# Altium schematic sheet 39.SchDoc
size 513 x 386 mm
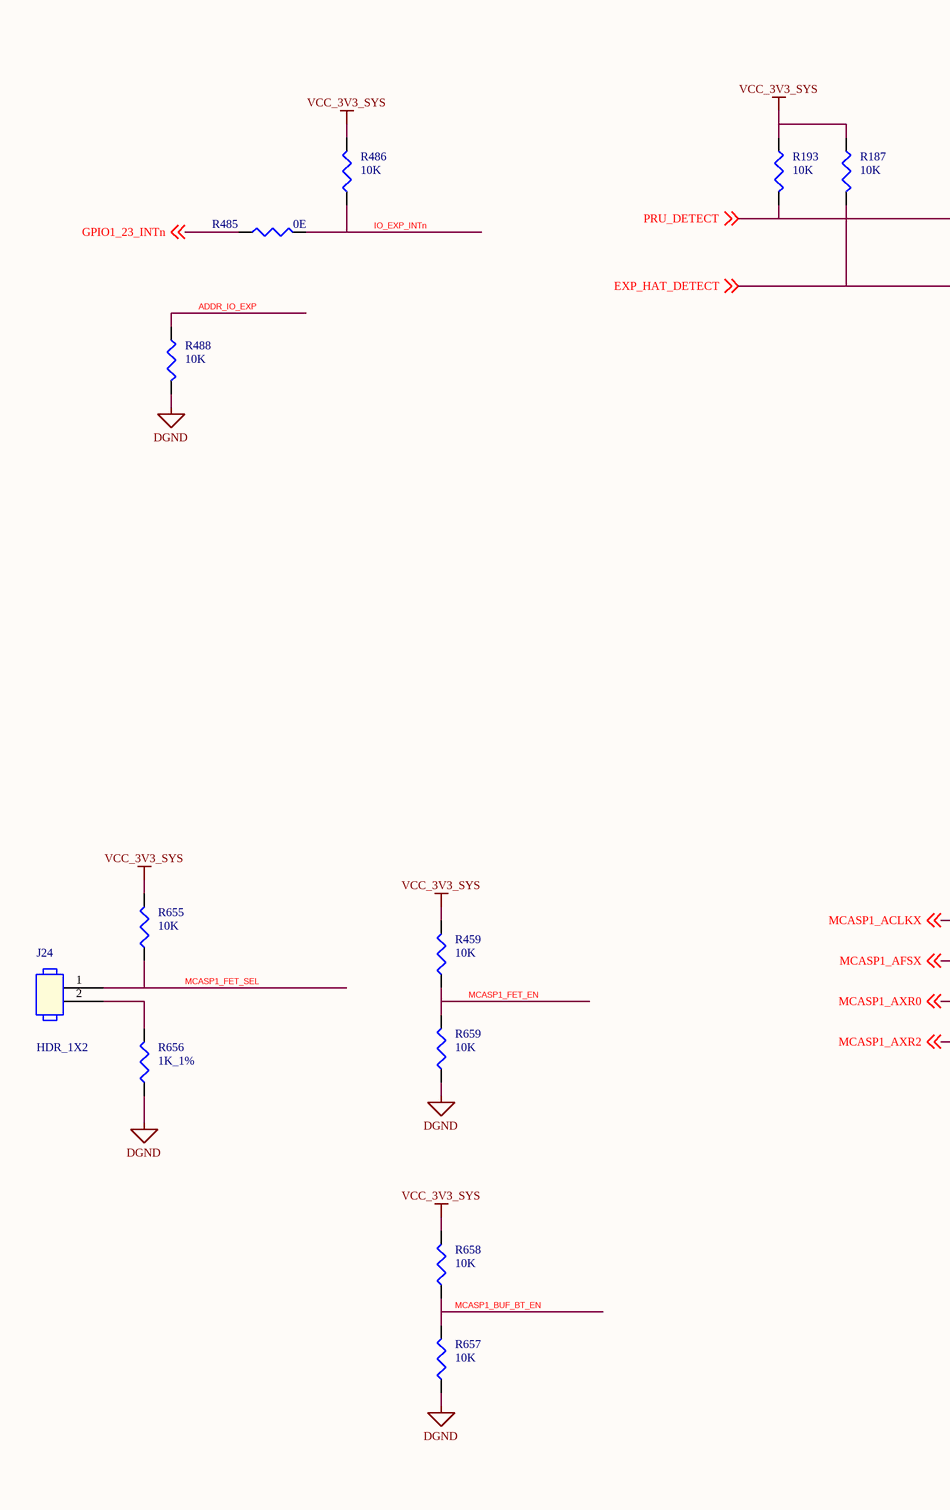
[diagram p0: 39.SchDoc, left]
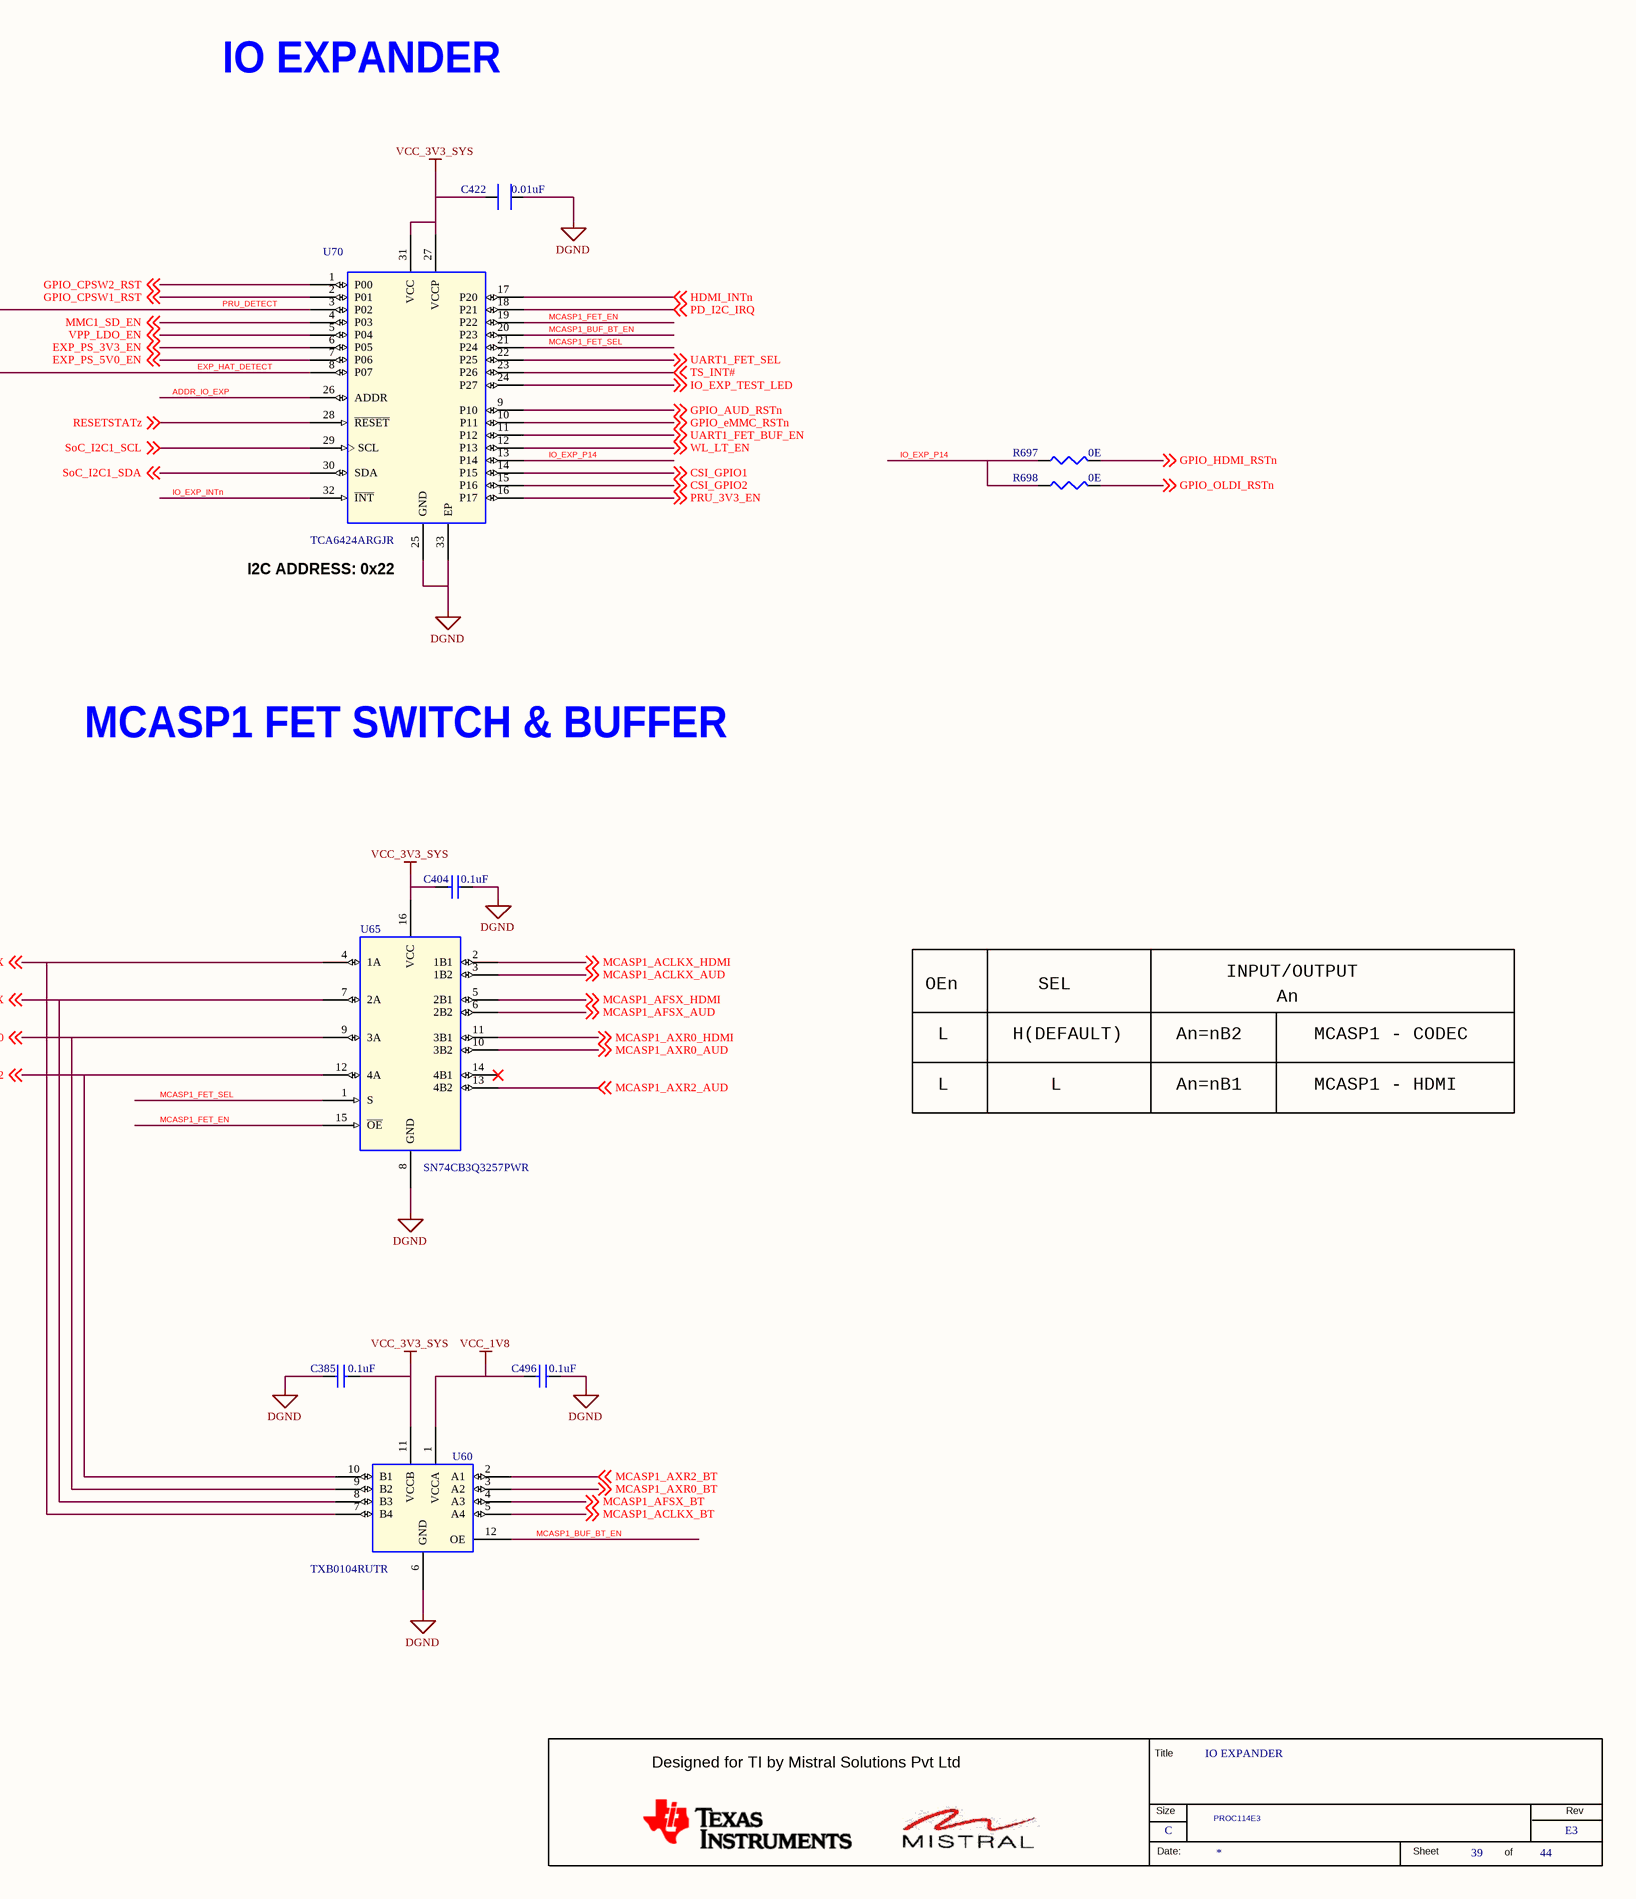
[diagram p1: 39.SchDoc, right]

## Parts
*  RevCode: E3  Title: IO EXPANDER  Page Size: C  Page Number: 39  Page Count: 44  Variant Name: PROC114E3  (hidden comment: MISTRAL_TITLEBLK_CSIZE)  (graphical)
C385  0.1uF  [CAP0201_0-5]
C404  0.1uF  [CAP0201_0-5]
C422  0.01uF  [CAP0402N]
C496  0.1uF  [CAP0201_0-5]
J24  HDR_1X2  [HDR_1X2_90120-0122_S_T_5-6]
R187  10K  [RES0201_0-5]
R193  10K  [RES0201_0-5]
R459  10K  [RES0201_0-5]
R485  0E  [RES0402_0-5]
R486  10K  [RES0201_0-5]
R488  10K  [RES0201_0-5]
R655  10K  [RES0201_0-5]
R656  1K_1%  [RES0402_0-5]
R657  10K  [RES0201_0-5]
R658  10K  [RES0201_0-5]
R659  10K  [RES0201_0-5]
R697  0E  [RES0201_0-5]
R698  0E  [RES0201_0-5]
U60  TXB0104RUTR  [UQFN12_TXB0104RUT_70X80_0-6]
U65  SN74CB3Q3257PWR  [TSSOP16_25-59_205X180]
U70  TCA6424ARGJR  [QFN32_19-68_200X200]

## Nets
DGND: C385.1 C404.1 C422.1 C496.1 R488.1 R656.1 R657.1 R659.1 U60.6(GND) U65.8(GND) U70.25(GND) U70.33(EP)
VCC_1V8: C496.2 U60.1(VCCA)
VCC_3V3_SYS: C385.2 C404.2 C422.2 R187.2 R193.2 R459.2 R486.2 R655.2 R658.2 U60.11(VCCB) U65.16(VCC) U70.27(VCCP) U70.31(VCC)
ADDR_IO_EXP: R488.2 U70.26(ADDR)
CSI_GPIO1: U70.14(P15) ; off-sheet CSI_GPIO1
CSI_GPIO2: U70.15(P16) ; off-sheet CSI_GPIO2
EXP_HAT_DETECT: R187.1 U70.8(P07) ; off-sheet EXP_HAT_DETECT
EXP_PS_3V3_EN: U70.6(P05) ; off-sheet EXP_PS_3V3_EN
EXP_PS_5V0_EN: U70.7(P06) ; off-sheet EXP_PS_5V0_EN
GPIO1_23_INTn: R485.1 ; off-sheet GPIO1_23_INTn
GPIO_AUD_RSTn: U70.9(P10) ; off-sheet GPIO_AUD_RSTn
GPIO_CPSW1_RST: U70.2(P01) ; off-sheet GPIO_CPSW1_RST
GPIO_CPSW2_RST: U70.1(P00) ; off-sheet GPIO_CPSW2_RST
GPIO_eMMC_RSTn: U70.10(P11) ; off-sheet GPIO_eMMC_RSTn
GPIO_HDMI_RSTn: R697.2 ; off-sheet GPIO_HDMI_RSTn
GPIO_OLDI_RSTn: R698.2 ; off-sheet GPIO_OLDI_RSTn
HDMI_INTn: U70.17(P20) ; off-sheet HDMI_INTn
IO_EXP_INTn: R485.2 R486.1 U70.32(~{INT})
IO_EXP_P14: R697.1 R698.1 U70.13(P14)
IO_EXP_TEST_LED: U70.24(P27) ; off-sheet IO_EXP_TEST_LED
MCASP1_ACLKX: U60.7(B4) U65.4(1A) ; off-sheet MCASP1_ACLKX
MCASP1_ACLKX_AUD: U65.3(1B2) ; off-sheet MCASP1_ACLKX_AUD
MCASP1_ACLKX_BT: U60.5(A4) ; off-sheet MCASP1_ACLKX_BT
MCASP1_ACLKX_HDMI: U65.2(1B1) ; off-sheet MCASP1_ACLKX_HDMI
MCASP1_AFSX: U60.8(B3) U65.7(2A) ; off-sheet MCASP1_AFSX
MCASP1_AFSX_AUD: U65.6(2B2) ; off-sheet MCASP1_AFSX_AUD
MCASP1_AFSX_BT: U60.4(A3) ; off-sheet MCASP1_AFSX_BT
MCASP1_AFSX_HDMI: U65.5(2B1) ; off-sheet MCASP1_AFSX_HDMI
MCASP1_AXR0: U60.9(B2) U65.9(3A) ; off-sheet MCASP1_AXR0
MCASP1_AXR0_AUD: U65.10(3B2) ; off-sheet MCASP1_AXR0_AUD
MCASP1_AXR0_BT: U60.3(A2) ; off-sheet MCASP1_AXR0_BT
MCASP1_AXR0_HDMI: U65.11(3B1) ; off-sheet MCASP1_AXR0_HDMI
MCASP1_AXR2: U60.10(B1) U65.12(4A) ; off-sheet MCASP1_AXR2
MCASP1_AXR2_AUD: U65.13(4B2) ; off-sheet MCASP1_AXR2_AUD
MCASP1_AXR2_BT: U60.2(A1) ; off-sheet MCASP1_AXR2_BT
MCASP1_BUF_BT_EN: R657.2 R658.1 U60.12(OE) U70.20(P23)
MCASP1_FET_EN: R459.1 R659.2 U65.15(~{OE}) U70.19(P22)
MCASP1_FET_SEL: J24.1 R655.1 U65.1(S) U70.21(P24)
MMC1_SD_EN: U70.4(P03) ; off-sheet MMC1_SD_EN
PD_I2C_IRQ: U70.18(P21) ; off-sheet PD_I2C_IRQ
PRU_3V3_EN: U70.16(P17) ; off-sheet PRU_3V3_EN
PRU_DETECT: R193.1 U70.3(P02) ; off-sheet PRU_DETECT
RESETSTATz: U70.28(~{RESET}) ; off-sheet RESETSTATz
SoC_I2C1_SCL: U70.29(SCL) ; off-sheet SoC_I2C1_SCL
SoC_I2C1_SDA: U70.30(SDA) ; off-sheet SoC_I2C1_SDA
TS_INT#: U70.23(P26) ; off-sheet TS_INT#
UART1_FET_BUF_EN: U70.11(P12) ; off-sheet UART1_FET_BUF_EN
UART1_FET_SEL: U70.22(P25) ; off-sheet UART1_FET_SEL
VPP_LDO_EN: U70.5(P04) ; off-sheet VPP_LDO_EN
WL_LT_EN: U70.12(P13) ; off-sheet WL_LT_EN
NetJ24_2: J24.2 R656.2

Not connected (* = marked no-connect by the designer): U65 14(4B1)*

## Notes on the sheet
- IO EXPANDER
- (near U70) I2C ADDRESS: 0x22
- MCASP1 FET SWITCH & BUFFER
- OEn
- SEL
- INPUT/OUTPUT
- An
- L
- H(DEFAULT)
- An=nB2
- MCASP1 - CODEC
- An=nB1
- MCASP1 - HDMI
- (in symbol MISTRAL_TITLEBLK_CSIZE) Title; Designed for TI by Mistral Solutions Pvt Ltd; Size; Rev; Date:; Sheet; of

## Library data of the parts
* = MISTRAL_TITLEBLK_CSIZE: Issue: 1.0; Page Create Date: March  8, 1995; Page Modify Date: *; Schematic Page Count: 44; Schematic Page Number: 39
C385 C404 = CAP_Dup2: CAP CERAMIC 0.1uF 16V 10% X5R 0201; Alt_Mfr_part_number: CC0402KRX5R8BB104; Mistral Part No: 120009030072-R; Mfr_name: MURATA; Mfr_part_number: GRM033R61C104KE14D; Part_type: CAPACITORS\CERAMIC; Alt_Mfr_name: YAGEO AMERICA; Project: TI_MAXIE_CPB; Wattage: NA; Customs_HS_Code: 85322990; Custom_Duty: 15%; PCB Footprint: CAP0201_0-5; Tolerance: 10%; Voltage: 16V; Package: 0201; Distributor_name: DIGIKEY; Distributor_part_number: 490-14305-1-ND; Height: 0.33MM; Weight: 0.33mg; Temperature: -55°C+85°C; Datasheet: Y:\MIS_DATABASE\DATASHEETS\CAPACITORS\GRM033R61C104KE14.PDF; Crtd /date: MANIRAJA/230118; Chkd/date: MANIRAJA/230118; MECHANICAL 3D STEP FILE: CAP0201_0-5; Library Ref: CAP; Footprint Ref: CAP0201_0-5; Library Path: Y:\MIS_DATABASE\Library\ALTIUM_TOOL\SCHEMATICS_PARTS\MS_DISCRETE_Library.schlib; Footprint Path: Y:\MIS_DATABASE\Library\ALTIUM_TOOL\PCB_FOOTPRINTS\Altium_Footprint_Lib.PcbLib
C422 = CAP_Dup3: CAP CERAMIC 0.01uF 25V 10% X5R 0201; Part_type: CAPACITORS\CERAMIC; Mfr_part_number: GRM033R61E103KA12J; Mfr_name: MURATA; Mistral Part No: 120018010007-R; PCB Footprint: CAP0201_0-5; Wattage: NA; Custom_Duty: 15%; Customs_HS_Code: 85322990; Project: TI_MAXIE_CPB; Footprint Path: Y:\MIS_DATABASE\Library\ALTIUM_TOOL\PCB_FOOTPRINTS\Altium_Footprint_Lib.PcbLib; Library Path: Y:\MIS_DATABASE\Library\ALTIUM_TOOL\SCHEMATICS_PARTS\MS_DISCRETE_Library.schlib; Footprint Ref: CAP0201_0-5; MECHANICAL 3D STEP FILE: CAP0201_0-5; Temperature: -55°C+85°C; Weight: 0.33mg; Chkd/date: MANIRAJA/230118; Crtd /date: MANIRAJA/230118; Datasheet: Y:\MIS_DATABASE\DATASHEETS\CAPACITORS\GRM033R61E103KA12.PDF; Height: 0.33MM; Distributor_part_number: GRM033R61E103KA12J-ND; Distributor_name: DIGIKEY; Package: 0201; Voltage: 25V; Tolerance: 10%; Library Ref: CAP
C496 = CAP_Dup2: CAP CERAMIC 0.1uF 16V 10% X5R 0201; Alt_Mfr_name: YAGEO AMERICA; Part_type: CAPACITORS\CERAMIC; Mfr_part_number: GRM033R61C104KE14D; Mfr_name: MURATA; Mistral Part No: 120009030072-R; Alt_Mfr_part_number: CC0402KRX5R8BB104; Custom_Duty: 15%; Customs_HS_Code: 85322990; Wattage: NA; Project: TI_MAXIE_CPB; PCB Footprint: CAP0201_0-5; Footprint Path: Y:\MIS_DATABASE\Library\ALTIUM_TOOL\PCB_FOOTPRINTS\Altium_Footprint_Lib.PcbLib; Library Path: Y:\MIS_DATABASE\Library\ALTIUM_TOOL\SCHEMATICS_PARTS\MS_DISCRETE_Library.schlib; Footprint Ref: CAP0201_0-5; Library Ref: CAP; MECHANICAL 3D STEP FILE: CAP0201_0-5; Chkd/date: MANIRAJA/230118; Crtd /date: MANIRAJA/230118; Datasheet: Y:\MIS_DATABASE\DATASHEETS\CAPACITORS\GRM033R61C104KE14.PDF; Temperature: -55°C+85°C; Weight: 0.33mg; Height: 0.33MM; Distributor_part_number: 490-14305-1-ND; Distributor_name: DIGIKEY; Package: 0201; Voltage: 16V; Tolerance: 10%
J24 = HEADER_2X1: CON HDR 1X2 2.54MM PITCH ST TH; Part_type: CONNECTOR\HEADERS; Mfr_part_number: 90120-0122; Mfr_name: MOLEX; Mistral Part No: 150012100005-R; Custom_Duty: 24%; Customs_HS_Code: 85369090; Project: NPOL_FEP; Tolerance: NA; Chkd/date: NAVEED/210714; Crtd /date: USMAN/031012; Datasheet: Y:\MIS_DATABASE\DATASHEETS\CONNECTORS\90120-XX.PDF; Height: 5.60MM; Distributor_part_number: WM8072-ND; Distributor_name: DIGIKEY; Package: THRU-HOLE; Voltage: NA; Wattage: NA; Weight: 122mg; Temperature: -55°C+125°C; MECHANICAL 3D STEP FILE: HDR_1X2_90120-0122_S_T_5-6; Library Path: Y:\MIS_DATABASE\Library\ALTIUM_TOOL\SCHEMATICS_PARTS\MS_CONNECTOR_Library.schlib; Footprint Path: Y:\MIS_DATABASE\Library\ALTIUM_TOOL\PCB_FOOTPRINTS\Altium_Footprint_Lib.PcbLib; Library Ref: HEADER_2X1; Footprint Ref: HDR_1X2_90120-0122_S_T_5-6; PCB Footprint: HDR_1X2_90120-0122_S_T_5-6
R187 R193 R486 R488 = RESISTOR_Dup6: RES 10K 1/20W 5% 0201; Part_type: RESISTORS\FIXED; Mfr_part_number: RC0201JR-0710KL; Mfr_name: YAGEO AMERICA; Mistral Part No: 110010070051-R; Custom_Duty: 15%; Customs_HS_Code: 85332119; Voltage: NA; Project: GOLDEN-I LITE; PCB Footprint: RES0201_0-5; MECHANICAL 3D STEP FILE: RES0201_0-5; Chkd/date: MANIRAJA/050517; Crtd /date: MANIRAJA/050517; Datasheet: Y:\MIS_DATABASE\DATASHEETS\RESISTORS\RCXXXXL-SER_MAR18.PDF; Temperature: -55°C+125°C; Weight: 0.17mg; Height: 0.26MM; Distributor_part_number: 311-10KNCT-ND; Distributor_name: DIGIKEY; Package: 0201; Wattage: 1/20W; Tolerance: 5%; Library Ref: RESISTOR; Footprint Ref: RES0201_0-5; Library Path: Y:\MIS_DATABASE\Library\ALTIUM_TOOL\SCHEMATICS_PARTS\MS_DISCRETE_Library.schlib; Footprint Path: Y:\MIS_DATABASE\Library\ALTIUM_TOOL\PCB_FOOTPRINTS\Altium_Footprint_Lib.PcbLib
R459 R655 R657-R659 = RESISTOR_Dup6: RES 10K 1/20W 5% 0201; Mistral Part No: 110010070051-R; Mfr_name: YAGEO AMERICA; Mfr_part_number: RC0201JR-0710KL; Part_type: RESISTORS\FIXED; Project: GOLDEN-I LITE; Voltage: NA; Customs_HS_Code: 85332119; Custom_Duty: 15%; Footprint Path: Y:\MIS_DATABASE\Library\ALTIUM_TOOL\PCB_FOOTPRINTS\Altium_Footprint_Lib.PcbLib; Library Path: Y:\MIS_DATABASE\Library\ALTIUM_TOOL\SCHEMATICS_PARTS\MS_DISCRETE_Library.schlib; Footprint Ref: RES0201_0-5; Library Ref: RESISTOR; Tolerance: 5%; Wattage: 1/20W; Package: 0201; Distributor_name: DIGIKEY; Distributor_part_number: 311-10KNCT-ND; Height: 0.26MM; Weight: 0.17mg; Temperature: -55°C+125°C; Datasheet: Y:\MIS_DATABASE\DATASHEETS\RESISTORS\RCXXXXL-SER_MAR18.PDF; Crtd /date: MANIRAJA/050517; Chkd/date: MANIRAJA/050517; MECHANICAL 3D STEP FILE: RES0201_0-5; PCB Footprint: RES0201_0-5
R485 = RESISTOR_Dup6: RES 0E 1/16W JUMPER 0402; Mistral Part No: 110010080019-R; Mfr_name: VISHAY; Mfr_part_number: CRCW04020000Z0ED; Part_type: RESISTORS\FIXED; Project: PB_BUGBASE; Tolerance: NA; Customs_HS_Code: 85332119; Custom_Duty: 15%; PCB Footprint: RES0402_0-5; Footprint Ref: RES0402_0-5; Voltage: NA; Wattage: 1/16W; Package: 0402; Distributor_name: DIGIKEY; Distributor_part_number: 541-0.0JCT-ND; Library Ref: RESISTOR; Height: 0.40MM; Weight: 0.65mg; Temperature: -55°C+155°C; Datasheet: Y:\MIS_DATABASE\DATASHEETS\RESISTORS\CRCW0603.PDF; Crtd /date: MUDDU/190810; Chkd/date: VASANTHA/201216; MECHANICAL 3D STEP FILE: RES0402_0-5; Library Path: Y:\MIS_DATABASE\Library\ALTIUM_TOOL\SCHEMATICS_PARTS\MS_DISCRETE_Library.schlib; Footprint Path: Y:\MIS_DATABASE\Library\ALTIUM_TOOL\PCB_FOOTPRINTS\Altium_Footprint_Lib.PcbLib
R656 = RESISTOR_Dup4: RES 1K 1/10W 1% 0402; Part_type: RESISTORS\FIXED; Mfr_part_number: ERJ-2RKF1001X; Mfr_name: PANASONIC-ECG; Mistral Part No: 110009030411-R; Custom_Duty: 15%; Customs_HS_Code: 85332119; Voltage: NA; Project: VOCERA; PCB Footprint: RES0402_0-5; Chkd/date: VASANTHA/281216; Crtd /date: MAZHAR/150506; Datasheet: Y:\MIS_DATABASE\DATASHEETS\RESISTORS\PAN-ERJSER_NOV17.PDF; Temperature: -55°C+155°C; Weight: 0.8mg; Height: 0.40MM; Distributor_part_number: P1.00KLCT-ND; Distributor_name: DIGIKEY; Package: 0402; Wattage: 1/10W; Tolerance: 1%; Library Ref: RESISTOR; Footprint Ref: RES0402_0-5; MECHANICAL 3D STEP FILE: RES0402_0-5; Library Path: Y:\MIS_DATABASE\Library\ALTIUM_TOOL\SCHEMATICS_PARTS\MS_DISCRETE_Library.schlib; Footprint Path: Y:\MIS_DATABASE\Library\ALTIUM_TOOL\PCB_FOOTPRINTS\Altium_Footprint_Lib.PcbLib
R697 R698 = RESISTOR_Dup6: RES 0E 1/20W 5% 0201; Part_type: RESISTORS\FIXED; Mfr_part_number: RC0201JR-070RL; Mfr_name: YAGEO AMERICA; Mistral Part No: 110010070067-R; Custom_Duty: 15%; Customs_HS_Code: 85332119; Voltage: NA; Project: PB_BUGBASE; Footprint Path: Y:\MIS_DATABASE\Library\ALTIUM_TOOL\PCB_FOOTPRINTS\Altium_Footprint_Lib.PcbLib; Library Path: Y:\MIS_DATABASE\Library\ALTIUM_TOOL\SCHEMATICS_PARTS\MS_DISCRETE_Library.schlib; MECHANICAL 3D STEP FILE: RES0201_0-5; Chkd/date: NAVEED/301214; Crtd /date: MUDDU/120710; Datasheet: Y:\MIS_DATABASE\DATASHEETS\RESISTORS\RCXXXXL-SER_MAR18.PDF; Temperature: -55°C+125°C; Weight: 0.17mg; Height: 0.26MM; Library Ref: RESISTOR; Distributor_part_number: 311-0.0NCT-ND; Distributor_name: DIGIKEY; Package: 0201; Wattage: 1/20W; Tolerance: 5%; Footprint Ref: RES0201_0-5; PCB Footprint: RES0201_0-5
U60 = TXB0104RUTR_UQFN12: IC 4-BIT BIDIRECTIONAL VOLTAGE-LEVEL TRANSLATOR UQFN12; Mistral Part No: 141017110007-R; Manufacturer: TEXAS INSTRUMENTS; Part_type: ICS\INTERFACE\LEVEL TRANSLATOR; Project: RSAPR_TYPE-II_3U-SBC; Tolerance: NA; Customs_HS_Code: 85423100; Custom_Duty: 15%; Mfr_part_number: TXB0104RUTR; Voltage: NA; Wattage: NA; Package: UQFN12; Distributor_name: DIGIKEY; Distributor_part_number: 296-25888-1-ND; Library Ref: TXB0104RUTR_UQFN12; Height: 0.55MM; Weight: 4.70mg; Temperature: -40°C+85°C; Datasheet: Y:\MIS_DATABASE\DATASHEETS\ICS\INTERFACE\TXB0104.PDF; Crtd /date: ALVY/271117; Chkd/date: MANIRAJA/281117; MECHANICAL 3D STEP FILE: UQFN12_TXB0104RUT_70X80_0-6; PCB Footprint: UQFN12_TXB0104RUT_70X80_0-6
U65 = SN74CB3Q3257PWR_TSSOP16: IC 4BIT 1-OF-2 FET MULTIPLEXER/DEMULTIPLEXER TSSOP16; Mistral Part No: 141009030117-R; Manufacturer: TEXAS INSTRUMENTS; Part_type: ICS\DIGITAL\COMBINATIONAL; Project: OMAP_EVM; Customs_HS_Code: 85423100; Custom_Duty: 15%; PCB Footprint: TSSOP16_25-59_205X180; Mfr_part_number: SN74CB3Q3257PWR; Package: TSSOP16; Distributor_name: DIGIKEY; Distributor_part_number: 296-19138-1-ND; Library Ref: SN74CB3Q3257PWR_TSSOP16; Height: 1.20MM; Temperature: -40°C+85°C; Datasheet: Y:\MIS_DATABASE\DATASHEETS\ICS\DIGITAL\COMBINATIONAL\SN74CB3Q3257.PDF; Crtd /date: USMAN/060109; Chkd/date: SUHAS/251010; RoHS: Sb/ Br FREE
U70 = TCA6424ARGJR_QFN32: IC I2C I/O EXPANDER 24B UQFN32; Mistral Part No: 141014090009-R; Mfr_name: TEXAS INSTRUMENTS; Part_type: ICS\DIGITAL\BUSTRANSCEIVER; Project: ZK_BIOMETRIC; Customs_HS_Code: 85423100; Custom_Duty: 15%; PCB Footprint: QFN32_19-68_200X200; Mfr_part_number: TCA6424ARGJR; Package: UQFN32; Distributor_name: DIGIKEY; Distributor_part_number: 296-27844-1-ND; Library Ref: TCA6424ARGJR_QFN32; Height: 0.60MM; Weight: NA; Temperature: -40°C+85°C; Datasheet: Y:\MIS_DATABASE\DATASHEETS\ICS\DIGITAL\BUSTRANSCEIVER\TCA6424AR.PDF; Crtd /date: NAVEED/100914; Chkd/date: NAVEED/100715